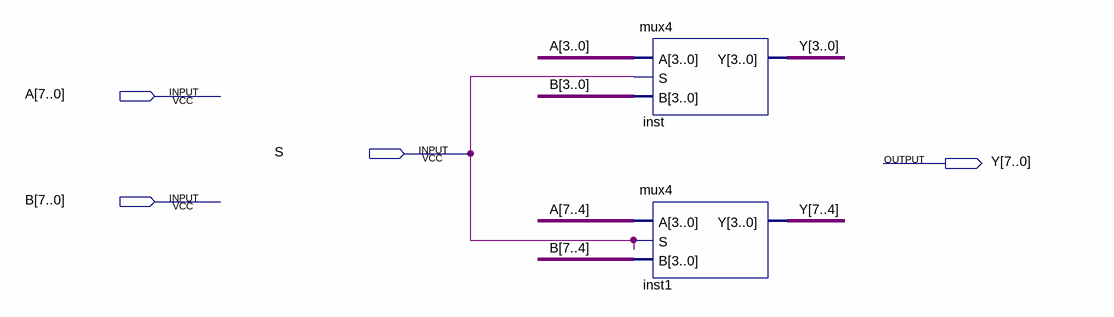
[diagram p0: schematic sheet]
// Quartus schematic mux8.bdf as structural Verilog: 2 symbols, 4 pins
module mux8 (
  input  [7:0] A,
  input  S,
  input  [7:0] B,
  output [7:0] Y
);

  mux4 inst (.A(A[3:0]), .S(S), .B(B[3:0]), .Y(Y[3:0]));
  mux4 inst1 (.A(A[7:4]), .S(S), .B(B[7:4]), .Y(Y[7:4]));
endmodule
